# EAGLE design Arduino-TPUART (EAGLE 6.0)
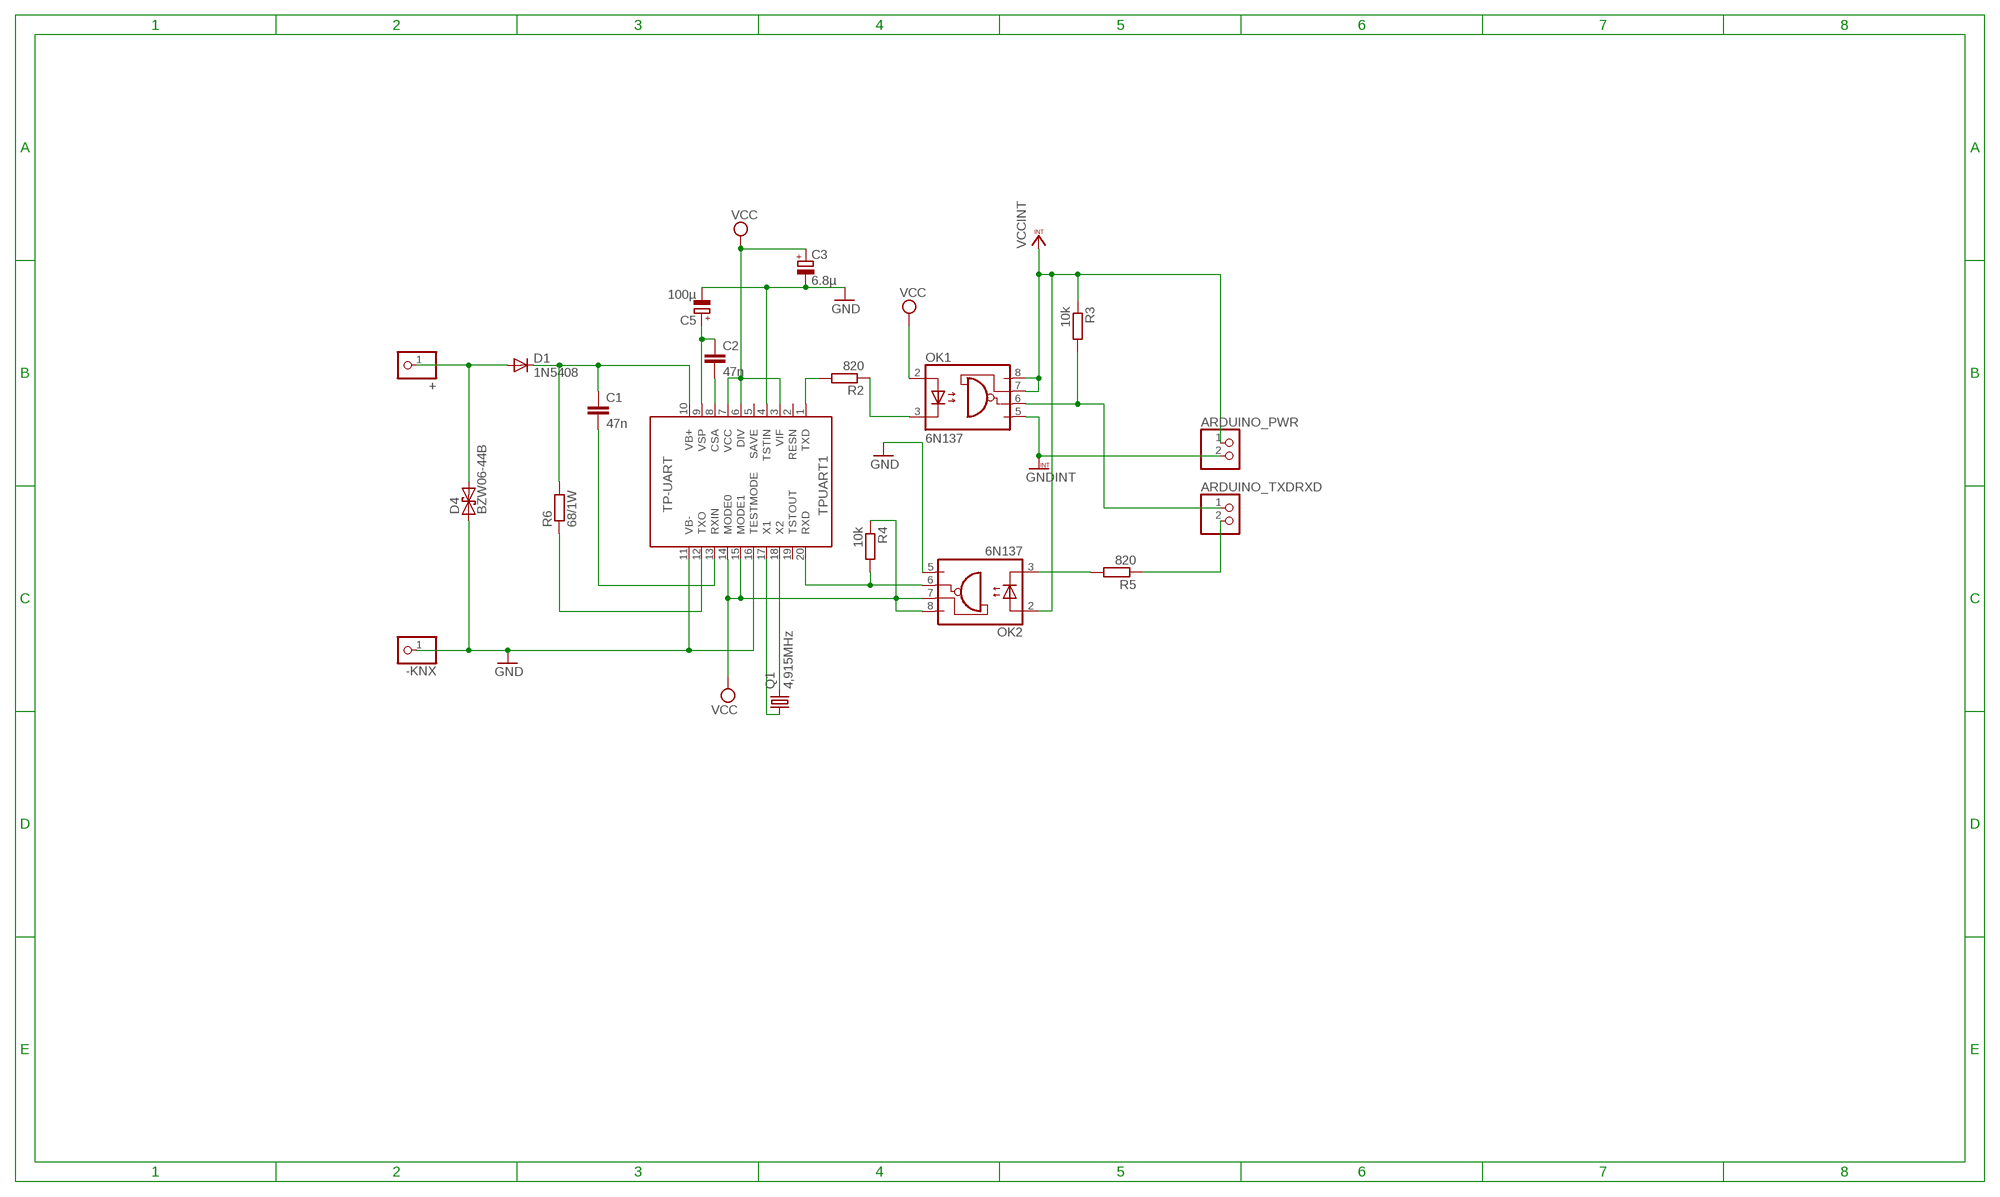
[diagram p0: schematic, sheet 1]

## Parts
+  PINHD-1X1  [1X01]
-KNX  PINHD-1X1  [1X01]
ARDUINO_PWR  PINHD-1X2  [1X02]
ARDUINO_TXDRXD  PINHD-1X2  [1X02]
C1  47n  C-EU025-025X050  [C025-025X050]
C2  47n  C-EU025-025X050  [C025-025X050]
C3  6.8µ  CPOL-EUE2-5  [E2-5]
C5  100µ  CPOL-EUE2.5-5  [E2,5-5]
D1  1N5408  1N5400  [DO201-15]
D4  BZW06-44B  BZW04XXB  [F126Z12]
OK1  6N137  [DIL08]
OK2  6N137  [DIL08]
Q1  4,915MHz  CRYSTALHC18U-V  [HC18U-V]
R2  820  R-EU_0411/12  [0411/12]
R3  10k  R-EU_0411/12  [0411/12]
R4  10k  R-EU_0411/12  [0411/12]
R5  820  R-EU_0411/12  [0411/12]
R6  68/1W  R-EU_0414/15  [0414/15]
TPUART1  TP-UART  [SOIC20]

## Nets
ARDUINO_RXD: ARDUINO_TXDRXD.1 OK1.6(VO) R3.2
ARDUINO_TXD: ARDUINO_TXDRXD.2 R5.1
GND [supply]: -KNX.1 C3.- C5.- D4.A OK2.5(GND) TPUART1.4(TSTIN) TPUART1.11(VB-) TPUART1.16(TESTMODE)
GNDINT [supply]: ARDUINO_PWR.2 OK1.5(GND)
KNX+ [supply]: +.1 D1.A D4.C
N$1 [supply]: C1.1 D1.C R6.2 TPUART1.10(VB+)
N$3: R6.1 TPUART1.12(TXO)
N$4: C1.2 TPUART1.13(RXIN)
N$5: C2.2 TPUART1.8(CSA)
N$6: C2.1 C5.+ TPUART1.9(VSP)
N$7: Q1.1 TPUART1.17(X1)
N$8: Q1.2 TPUART1.18(X2)
N$9: R2.2 TPUART1.1(TXD)
N$10: OK1.3(C) R2.1
N$12: OK2.6(VO) R4.2 TPUART1.20(RXD)
N$14: OK2.3(C) R5.2
VCC [supply]: C3.+ OK1.2(A) OK2.7(VE) OK2.8(VCC) R4.1 TPUART1.3(VIF) TPUART1.6(DIV) TPUART1.7(VCC) TPUART1.14(MODE0) TPUART1.15(MODE1)
VCCINT [supply]: ARDUINO_PWR.1 OK1.7(VE) OK1.8(VCC) OK2.2(A) R3.1
Unconnected: TPUART1.2(RESN) TPUART1.5(SAVE) TPUART1.19(TSTOUT)

## Library data of the parts
+ -KNX = pinhead:PINHD-1X1: PIN HEADER
ARDUINO_PWR ARDUINO_TXDRXD = pinhead:PINHD-1X2: PIN HEADER
C1 C2 = rcl:C-EU: CAPACITOR, European symbol
C3 C5 = resistor:CPOL-EU: POLARIZED CAPACITOR, European symbol
D1 = diode:1N5400: DIODE standard rectifier, 3 A, 50 V (Motorola)
D4 = diode:BZW04XXB: DIODE uni and bidirectional supressor diode
OK1 OK2 = optocoupler:6N137: MOTOROLA OPTO COUPLER; MPN: 6N137; OC_FARNELL: 1328376; OC_NEWARK: 52M1895
Q1 = crystal:CRYSTAL: CRYSTAL; OC_FARNELL: unknown; OC_NEWARK: unknown
R2-R6 = resistor:R-EU_: RESISTOR, European symbol
TPUART1 = tpuart-actiface:TP-UART: Siemens TP-UART

## Net classes
0 default: width 0.3 mm
1 supply: width 0.6 mm

## Board
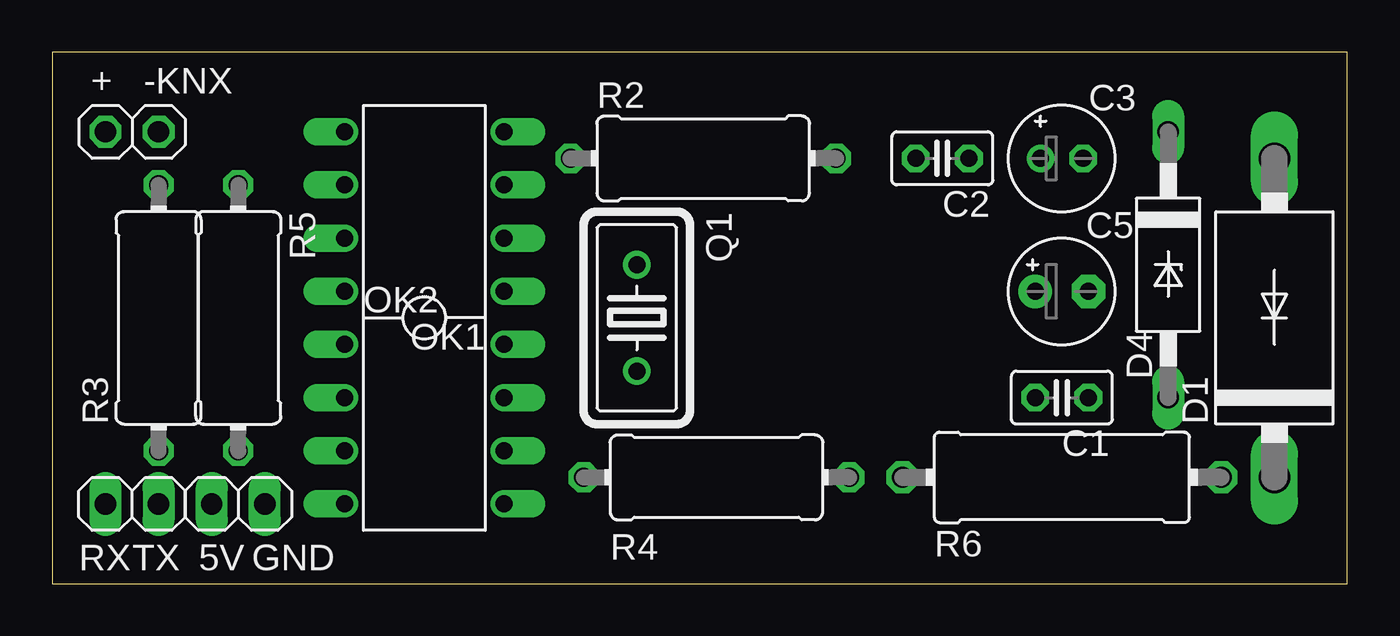
[diagram p1: board, top side]
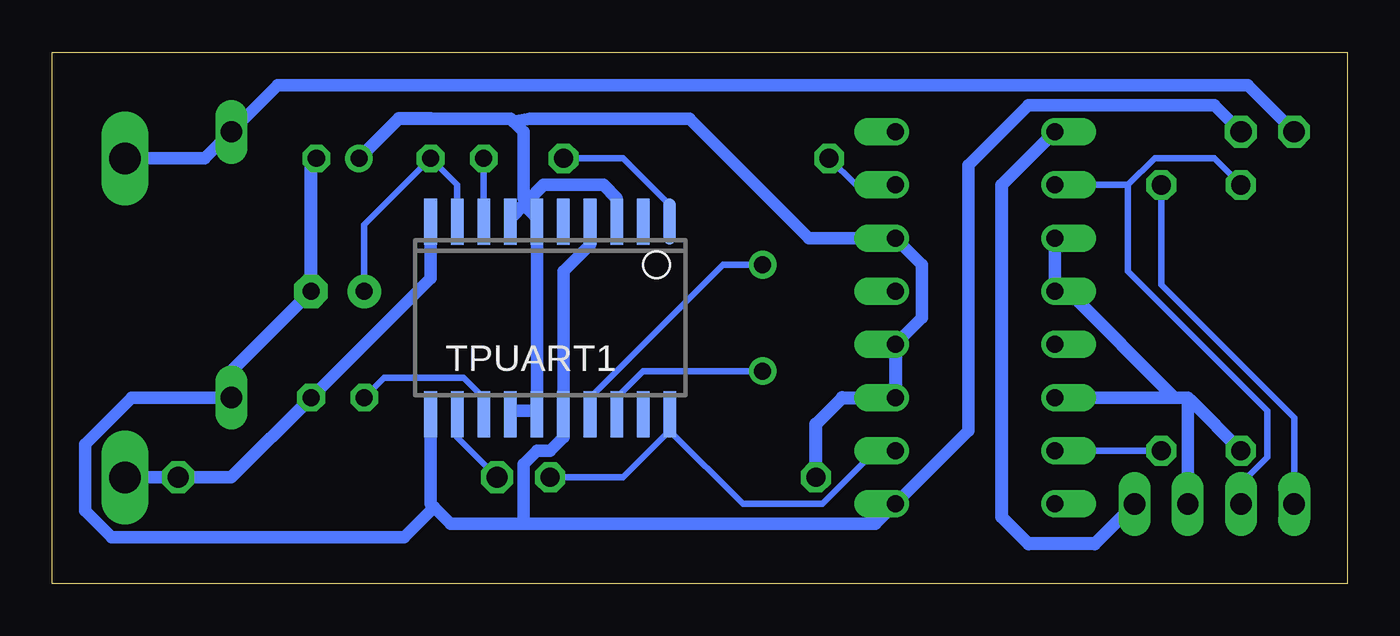
[diagram p2: board, bottom side, seen from below]

Size 61.9 x 25.39 mm. Coordinates in mm from the lower left corner, seen from the top.
Outline: 0,0 61.9,0 61.9,25.39 0,25.39 0,0
Copper layers (1*16): Top 0.035mm / dielectric 1.5mm / Bottom 0.035mm
Design rules "default": minimum track width 10mil, minimum drill 24mil, track to track 8mil, track to pad 8mil, pad to pad 8mil, via to via 8mil, smd to smd 8mil, copper to edge 40mil, drill to drill 8mil, minimum pad ring 10mil, minimum via ring 8mil, stop-mask expansion 4mil, vias tented up to drill 0mil, thermal gap 10mil

### Footprints (pad centres in the part's own frame; a part is rotated, then mirrored left to right if it is on the bottom)
1X01 = drill 1.016 octagon: 1 0,0
1X02 = drill 1.016 long: 1 -1.27,0; 2 1.27,0
C025-025X050 = drill 0.813 octagon: 1 -1.27,0; 2 1.27,0
E2-5 = drill 0.813 pad 1.27: + -1.016,0 | drill 0.813 pad 1.27 octagon: - 1.016,0
E2,5-5 = drill 0.813 pad 1.6: + -1.27,0 | drill 0.813 pad 1.6 octagon: - 1.27,0
DO201-15 = drill 1.499 long: A 7.62,0; C -7.62,0
F126Z12 = drill 1.016 long: A 6.35,0; C -6.35,0
DIL08 = drill 0.813 offset: 1 -3.81,-3.81; 2 -1.27,-3.81; 3 1.27,-3.81; 4 3.81,-3.81; 5 3.81,3.81; 6 1.27,3.81; 7 -1.27,3.81; 8 -3.81,3.81
HC18U-V = drill 0.813: 1 -2.54,0; 2 2.54,0
0411/12 = drill 0.914 octagon: 1 -6.35,0; 2 6.35,0
0414/15 = drill 1.016 octagon: 1 -7.62,0; 2 7.62,0
SOIC20 = smd 0.6 x 2.2: 1 -5.715,-4.6; 2 -4.445,-4.6; 3 -3.175,-4.6; 4 -1.905,-4.6; 5 -0.635,-4.6; 6 0.635,-4.6; 7 1.905,-4.6; 8 3.175,-4.6; 9 4.445,-4.6; 10 5.715,-4.6; 11 5.715,4.6; 12 4.445,4.6; 13 3.175,4.6; 14 1.905,4.6; 15 0.635,4.6; 16 -0.635,4.6; 17 -1.905,4.6; 18 -3.175,4.6; 19 -4.445,4.6; 20 -5.715,4.6

### Placement (x,y rotation side)
+  2.54,21.59 0 top
-KNX  5.08,21.59 0 top
ARDUINO_PWR  8.89,3.81 0 top
ARDUINO_TXDRXD  3.81,3.81 180 top
C1  48.26,8.89 180 top
C2  42.55,20.32 180 top
C3  48.26,20.32 0 top
C5  48.26,13.97 0 top
D1  58.42,12.7 90 top
D4  53.34,15.24 270 top
OK1  17.78,17.78 90 top
OK2  17.78,7.62 270 top
Q1  27.94,12.7 270 top
R2  31.11,20.32 0 top
R3  5.08,12.7 90 top
R4  31.75,5.08 0 top
R5  8.89,12.7 270 top
R6  48.26,5.08 0 top
TPUART1  38.1,12.7 180 bottom

### Tracks (layer width: path | path; a pad name or v marks a point on that pad's centre or on a via)
ARDUINO_RXD
  Bottom 0.3: 10.48,19.05 OK1.6 | 10.48,19.05 9.21,20.32 6.35,20.32 R3.2 | ARDUINO_TXDRXD.1 5.08,4.76 3.81,6.03 3.81,8.26 10.48,14.92 10.48,19.05
ARDUINO_TXD
  Bottom 0.3: R5.1 8.89,14.29 2.54,7.94 ARDUINO_TXDRXD.2
GND
  Bottom 0.6: TPUART1.4 36.2,16.19 37.47,14.92 TPUART1.16 37.47,6.98 38.1,6.35 38.73,6.35 39.37,5.71 39.37,2.86 | TPUART1.11 43.81,3.81 43.66,3.65 | 43.66,3.65 42.86,2.86 39.37,2.86 | 39.37,2.86 22.54,2.86 OK2.5 18.1,7.3 18.1,20 15.24,22.86 6.35,22.86 -KNX.1 | D4.A 58.1,8.89 60.33,6.67 60.33,3.49 59.05,2.22 45.09,2.22 43.66,3.65
  Bottom 0.61: D4.A 53.34,10.16 C5.- 49.53,20.07 C3.-
GNDINT
  Bottom 0.61: ARDUINO_PWR.2 12.06,1.91 15.24,1.91 16.51,3.17 16.51,19.05 OK1.5
KNX+
  Bottom 0.6: D1.A 54.61,20.32 D4.C 51.12,23.81 4.76,23.81 +.1
N$1
  Bottom 0.6: D1.C R6.2 53.34,5.08 C1.1 43.81,14.61 TPUART1.10
N$3
  Bottom 0.3: TPUART1.12 42.55,6.98 R6.1
N$4
  Bottom 0.3: TPUART1.13 41.27,8.89 42.23,9.84 46.04,9.84 C1.2
N$5
  Bottom 0.3: C2.2 TPUART1.8
N$6
  Bottom 0.3: TPUART1.9 42.55,19.05 C2.1
  Bottom 0.305: C5.+ 46.99,17.14 C2.1
N$7
  Bottom 0.3: TPUART1.17 36.2,8.89 29.84,15.24 Q1.1
N$8
  Bottom 0.3: TPUART1.18 34.92,8.89 33.66,10.16 Q1.2
N$9
  Bottom 0.3: TPUART1.1 32.38,18.1 34.61,20.32 R2.2
N$10
  Bottom 0.3: OK1.3 23.5,19.05 R2.1
N$12
  Bottom 0.3: 32.38,7.3 TPUART1.20 32.38,7.94 | 32.38,7.3 34.61,5.08 R4.2 | OK2.6 22.54,6.35 25.08,3.81 28.89,3.81 32.38,7.3
N$14
  Bottom 0.3: R5.2 OK2.3
VCC
  Bottom 0.6: OK2.8 20.32,12.7 20.32,15.24 OK1.2 25.72,16.51 31.43,22.22 39.05,22.22 39.85,22.07 | 38.73,8.26 40.01,8.26 TPUART1.14 | TPUART1.3 34.92,18.41 35.56,19.05 38.42,19.05 39.21,18.26 | 39.37,18.1 40.01,17.46 TPUART1.7 | 39.37,18.1 39.21,18.26 | 39.37,18.1 38.73,17.46 TPUART1.6 38.73,8.26 | 38.73,8.26 TPUART1.15 | 43.81,22.22 40.01,22.22 39.85,22.07 | 39.85,22.07 39.37,21.59 39.37,18.41 39.21,18.26
  Bottom 0.61: OK2.8 OK2.7 24.13,8.89 25.4,7.62 R4.1 | 43.81,22.22 45.34,22.22 C3.+
VCCINT
  Bottom 0.6: OK1.7 OK1.8 13.34,13.97 8.26,8.89 | 8.26,8.89 7.62,8.89 7.46,8.73 | 8.26,8.89 OK2.2 | R3.1 7.46,8.73 | ARDUINO_PWR.1 7.62,8.57 7.46,8.73

### Text on the board
tNames: RX | TX | 5V | GND